# EAGLE design XBee Shield v2.0b (EAGLE 6.3)
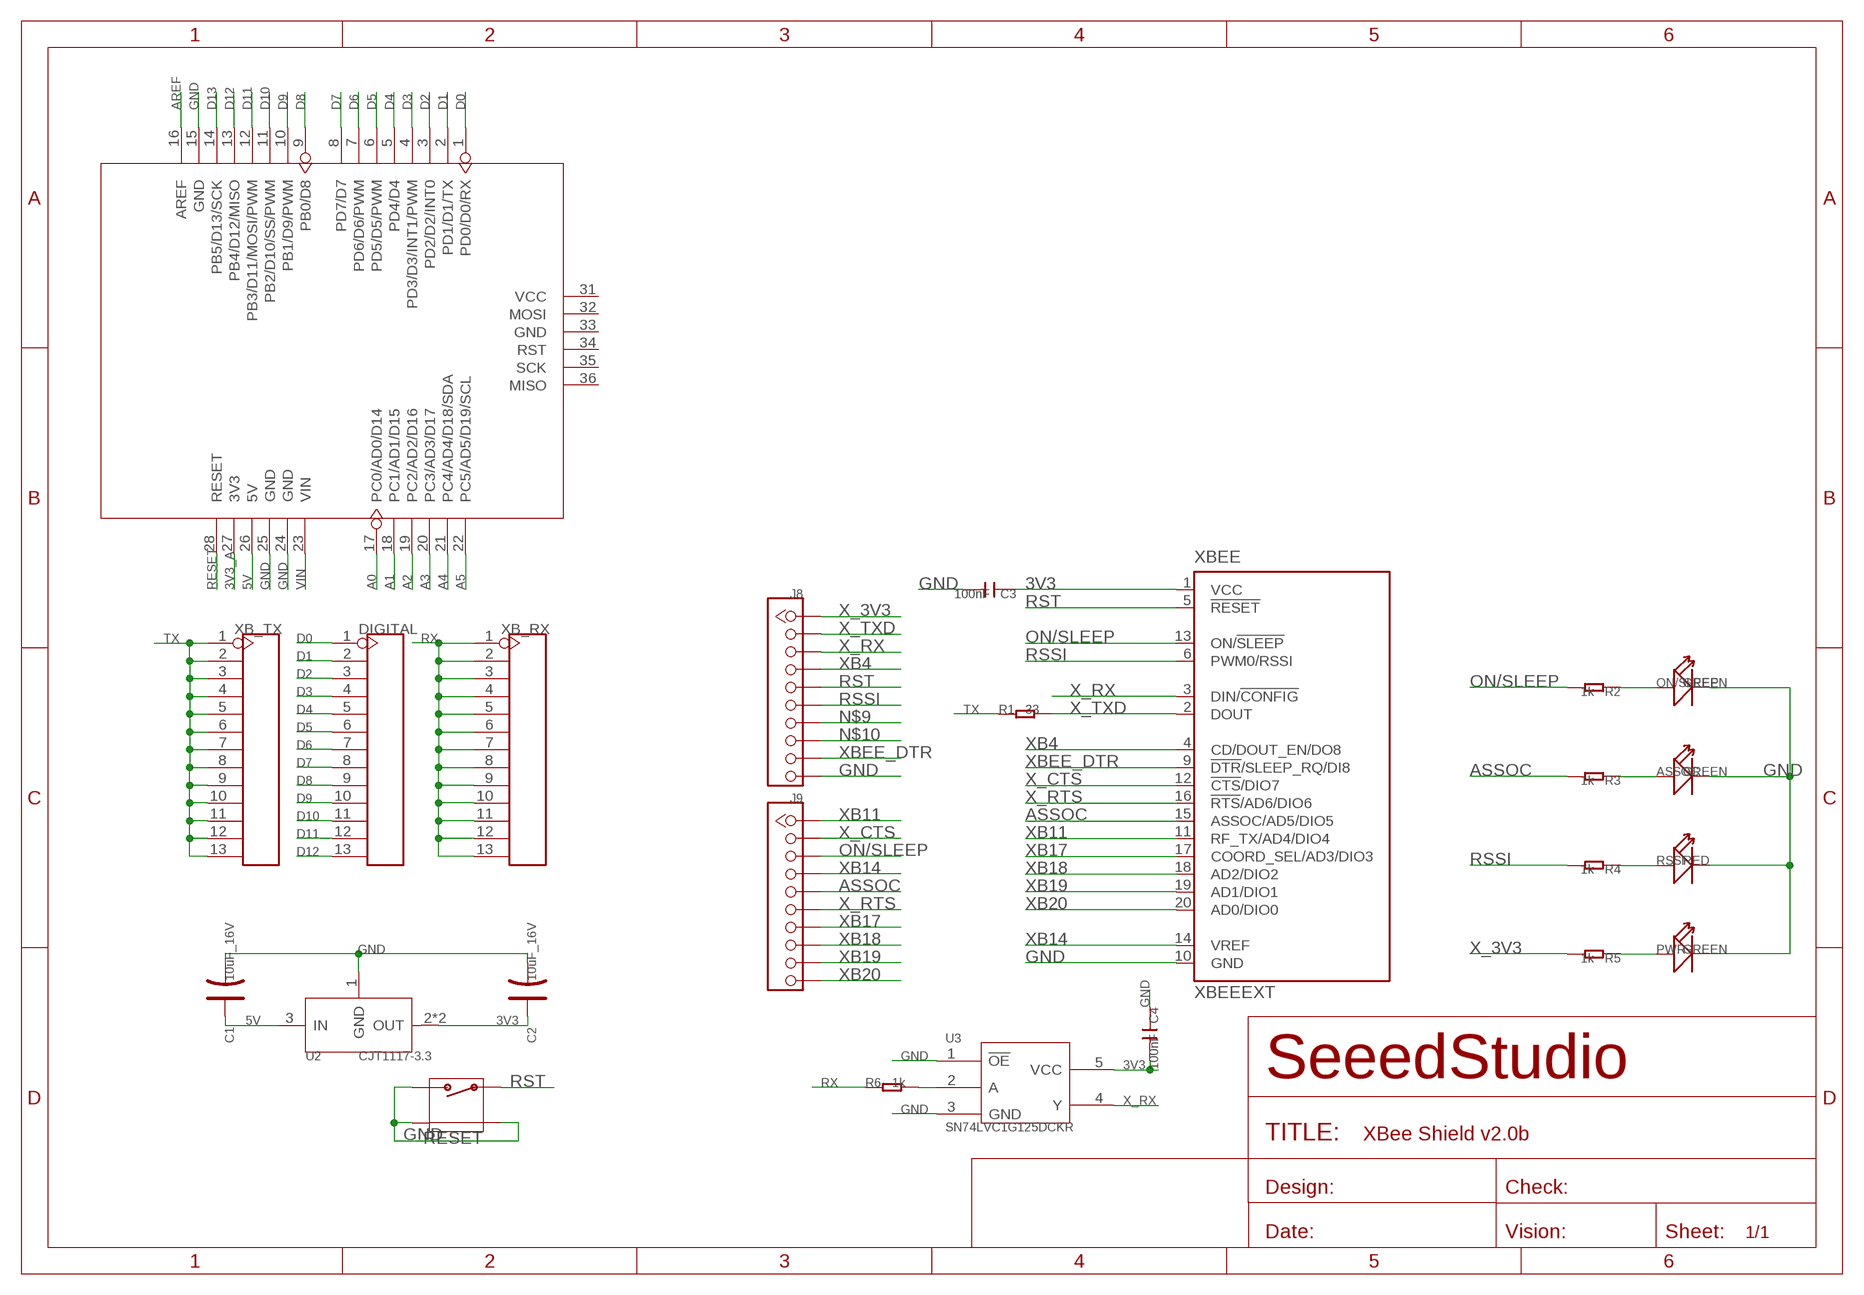
[diagram p0: schematic, sheet 1]

## Parts
ASSOC  GREEN  LED'0603'  [LED-0603]
C1  10uF_16V  CAP-AVX-A  [AVX-A]
C2  10uF_16V  CAP-AVX-A  [AVX-A]
C3  100nF  C-0603  [C0603]
C4  100nF  C-0603  [C0603]
DIGITAL  HEADER-13P  [13P-2.54]
J8  DNP  CK1X10DD  [CK1X10]
J9  DNP  CK1X10DD  [CK1X10]
ON/SLEEP  GREEN  LED'0603'  [LED-0603]
PWR  GREEN  LED'0603'  [LED-0603]
R1  33  R-0603  [R0603]
R2  1k  R-0603  [R0603]
R3  1k  R-0603  [R0603]
R4  1k  R-0603  [R0603]
R5  1k  R-0603  [R0603]
R6  1k  R-0603  [R0603]
RESET  FOR_TEST_ALBERT_V6_BUTTON_4P_SMD  [FOR_TEST_ALBERT_V6_4P-SMD-7X3.5X3.5]
RSSI  RED  LED'0603'  [LED-0603]
U1  ARDUINO'W/O-SILK'  [ARDUINO-W/O-SILK]
U2  CJT1117-3.3  LD1117S  [SOT-223]
U3  SN74LVC1G125DCKR  [SOT353]
XB_RX  HEADER-13P  [13P-2.54]
XB_TX  HEADER-13P  [13P-2.54]
XBEE  XBEEEXT  [XBEE_PLUG]

## Nets
3V3: C2.+ C3.1 C4.2 U2.2(OUT) U2.TER(OUT) U3.5(VCC) XBEE.1(VCC)
3V3_A: U1.27(3V3)
5V: C1.+ U1.26(5V) U2.3(IN)
A0: U1.17(PC0/AD0/D14)
A1: U1.18(PC1/AD1/D15)
A2: U1.19(PC2/AD2/D16)
A3: U1.20(PC3/AD3/D17)
A4: U1.21(PC4/AD4/D18/SDA)
A5: U1.22(PC5/AD5/D19/SCL)
AREF: U1.16(AREF)
ASSOC: J9.5 R3.2 XBEE.15(ASSOC/AD5/DIO5)
D0: DIGITAL.1 U1.1(PD0/D0/RX)
D1: DIGITAL.2 U1.2(PD1/D1/TX)
D2: DIGITAL.3 U1.3(PD2/D2/INT0)
D3: DIGITAL.4 U1.4(PD3/D3/INT1/PWM)
D4: DIGITAL.5 U1.5(PD4/D4)
D5: DIGITAL.6 U1.6(PD5/D5/PWM)
D6: DIGITAL.7 U1.7(PD6/D6/PWM)
D7: DIGITAL.8 U1.8(PD7/D7)
D8: DIGITAL.9 U1.9(PB0/D8)
D9: DIGITAL.10 U1.10(PB1/D9/PWM)
D10: DIGITAL.11 U1.11(PB2/D10/SS/PWM)
D11: DIGITAL.12 U1.12(PB3/D11/MOSI/PWM)
D12: DIGITAL.13 U1.13(PB4/D12/MISO)
D13: U1.14(PB5/D13/SCK)
GND: ASSOC.- C1.- C2.- C3.2 C4.1 J8.10 ON/SLEEP.- PWR.- RESET.2 RESET.S1 RESET.S2 RSSI.- U1.15(GND) U1.24(GND) U1.25(GND) U2.1(GND) U3.1(!OE!) U3.3(GND) XBEE.10(GND)
N$7: ON/SLEEP.+ R2.1
N$8: ASSOC.+ R3.1
N$9: J8.7
N$10: J8.8
N$11: R4.1 RSSI.+
N$14: PWR.+ R5.1
N$132: R6.2 U3.2(A)
ON/SLEEP: J9.3 R2.2 XBEE.13(ON/!SLEEP)
RESET: U1.28(RESET)
RSSI: J8.6 R4.2 XBEE.6(PWM0/RSSI)
RST: J8.5 RESET.1 XBEE.5(!RESET)
RX: R6.1 XB_RX.1 XB_RX.2 XB_RX.3 XB_RX.4 XB_RX.5 XB_RX.6 XB_RX.7 XB_RX.8 XB_RX.9 XB_RX.10 XB_RX.11 XB_RX.12 XB_RX.13
TX: R1.1 XB_TX.1 XB_TX.2 XB_TX.3 XB_TX.4 XB_TX.5 XB_TX.6 XB_TX.7 XB_TX.8 XB_TX.9 XB_TX.10 XB_TX.11 XB_TX.12 XB_TX.13
VIN: U1.23(VIN)
X_3V3: J8.1 R5.2
X_CTS: J9.2 XBEE.12(!CTS!/DIO7)
X_RTS: J9.6 XBEE.16(!RTS!/AD6/DIO6)
X_RX: J8.3 U3.4(Y) XBEE.3(DIN/!CONFIG)
X_TXD: J8.2 R1.2 XBEE.2(DOUT)
XB4: J8.4 XBEE.4(CD/DOUT_EN/DO8)
XB11: J9.1 XBEE.11(RF_TX/AD4/DIO4)
XB14: J9.4 XBEE.14(VREF)
XB17: J9.7 XBEE.17(COORD_SEL/AD3/DIO3)
XB18: J9.8 XBEE.18(AD2/DIO2)
XB19: J9.9 XBEE.19(AD1/DIO1)
XB20: J9.10 XBEE.20(AD0/DIO0)
XBEE_DTR: J8.9 XBEE.9(!DTR!/SLEEP_RQ/DI8)
Unconnected: U1.31(VCC) U1.32(MOSI) U1.33(GND) U1.34(RST) U1.35(SCK) U1.36(MISO)

## Library data of the parts
ASSOC ON/SLEEP PWR RSSI = Discrete:LED*
C1 C2 = Discrete:CAP*: Electrolytic Capacitors,Tantalum Capacitors and Super Capacitors
C3 C4 = Discrete:C*: Ceramic Capacitors
DIGITAL XB_RX XB_TX = Connector:HEADER-13P
J8 J9 = CONNECTER:CK1X10
R1-R6 = Discrete:R*
RESET = TFT_Touch:FOR_TEST_ALBERT_V6_BUTTON_4P_SMD: TS-1188E http://www.best-dz.com/?thread-374-2.html
U1 = moudle:ARDUINO
U2 = IC:LD1117: Low Drop Fixed And Adjustable Positive Voltage Regulators http://www.datasheetcatalog.org/datasheet/SGSThomsonMicroelectronics/mXuqtqv.pdf
U3 = Test:SN74LVC1G125DCKR: Signal bus buffer gate
XBEE = EXT_moudle:XBEE: XBee (TM) /XBee-PRO(TM) OEM RF Modules Source: MaxStream, Inc. xbee_productmanual.pdf

## Net classes
1 power: width 0.61 mm

## Board
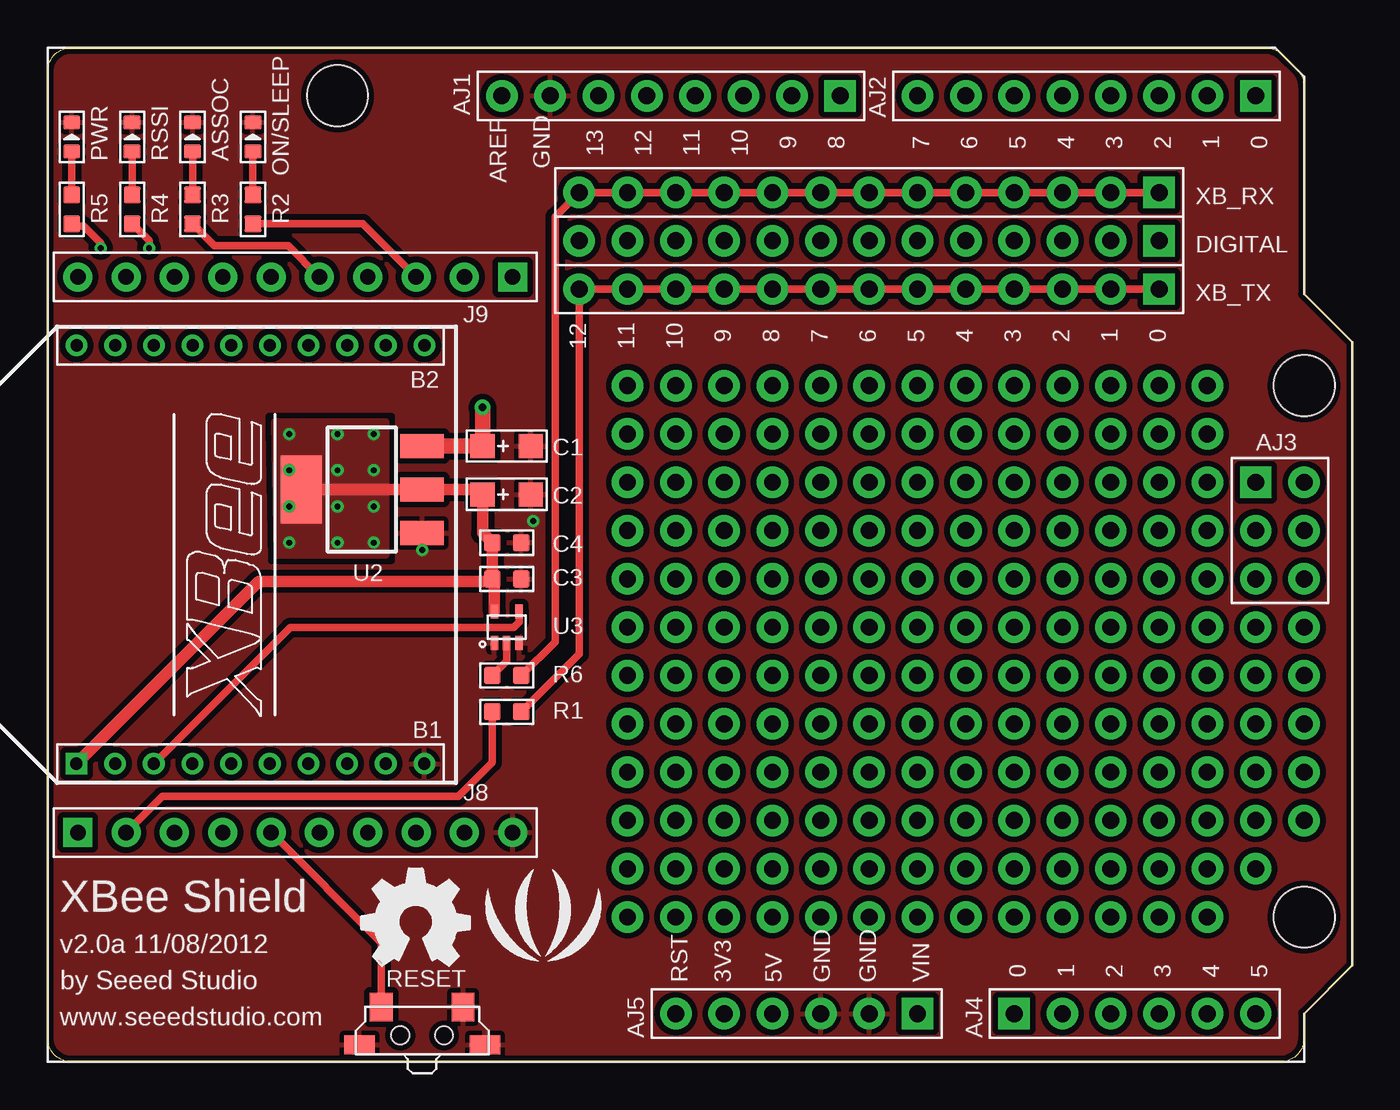
[diagram p1: board, top side]
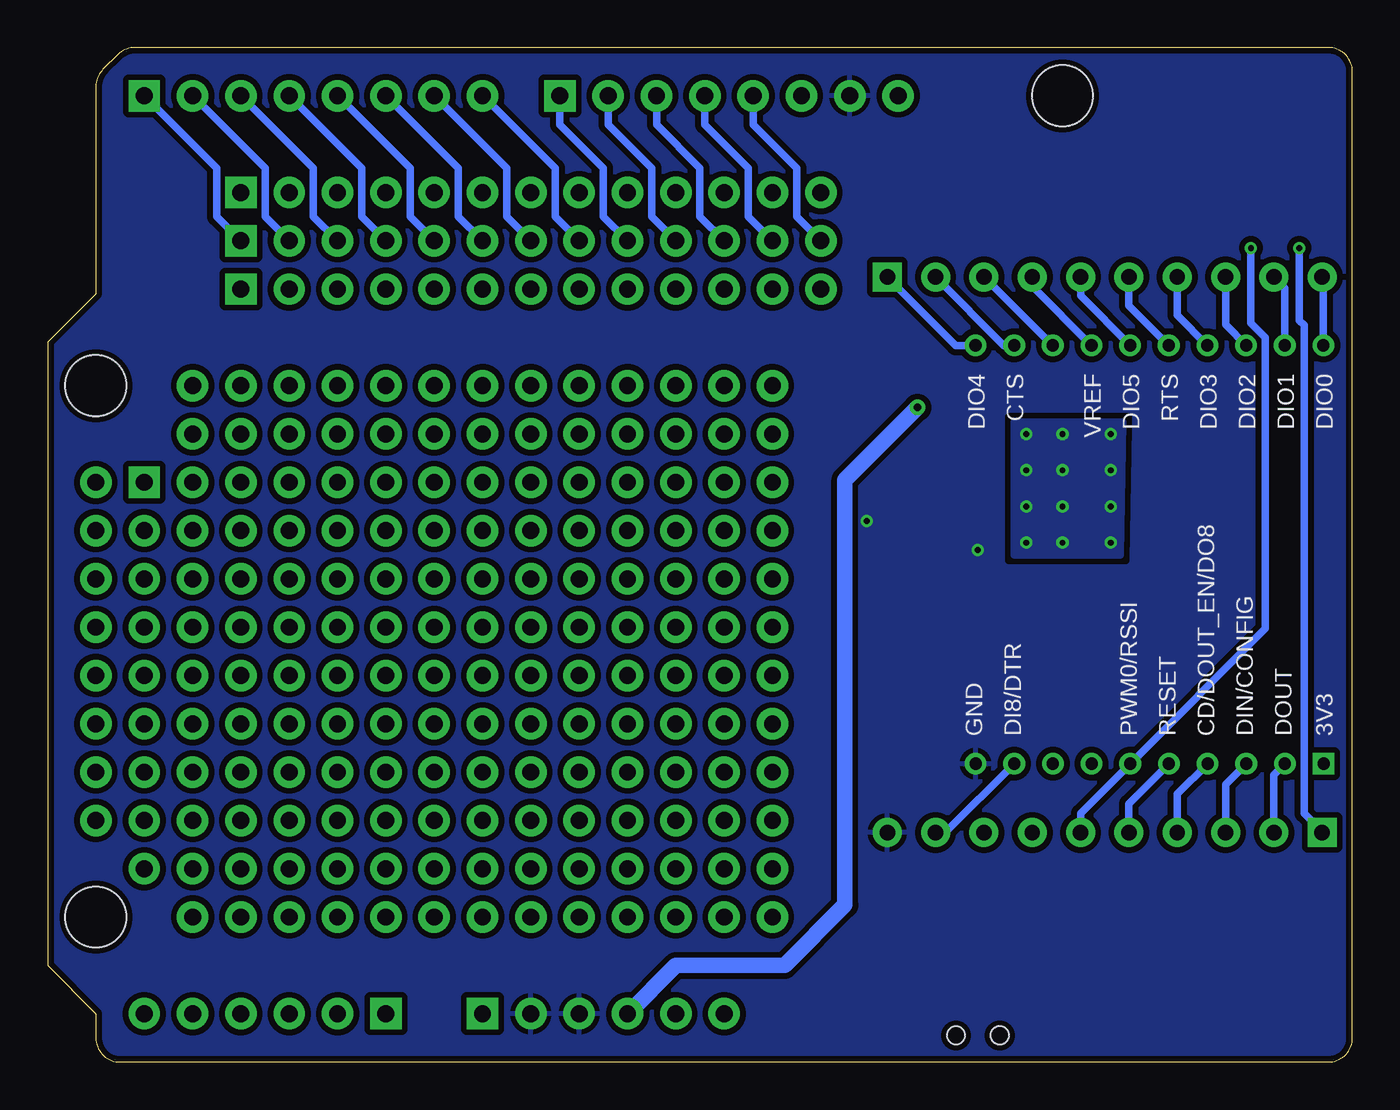
[diagram p2: board, bottom side, seen from below]

Size 68.58 x 53.34 mm. Coordinates in mm from the lower left corner, seen from the top.
Outline: 66.04,2.54 66.04,1.27 arc-90 64.77,0 1.27,0 arc-90 0,1.27 0,52.07 arc-90 1.27,53.34 63.99,53.34 arc-45 64.89,52.97 65.67,52.19 arc-45 66.04,51.29 66.04,40.39 68.58,37.85 68.58,5.08 66.04,2.54
Copper layers (1*16): Top 0.035mm / dielectric 1.5mm / Bottom 0.035mm
Design rules "SeeedStudio_rule_no_angle_090911 *": minimum track width 6mil, minimum drill 12mil, track to track 6mil, track to pad 6mil, pad to pad 6mil, via to via 6mil, smd to smd 0mil, copper to edge 10mil, drill to drill 10mil, minimum pad ring 10mil, minimum via ring 6mil, stop-mask expansion 2mil, vias tented up to drill 25mil, thermal gap 10mil

### Footprints (pad centres in the part's own frame; a part is rotated, then mirrored left to right if it is on the bottom)
LED-0603 = smd 0.762 x 0.889: + -0.762,0; - 0.762,0
AVX-A = smd 1.27 x 1.27: + -1.27,0; - 1.27,0
C0603 = smd 0.889 x 0.889: 1 -0.762,0; 2 0.762,0
13P-2.54 = drill 0.889 pad 1.651 square: 1 -15.24,0 | drill 0.889 pad 1.651: 2 -12.7,0; 3 -10.16,0; 4 -7.62,0; 5 -5.08,0; 6 -2.54,0; 7 0,0; 8 2.54,0; 9 5.08,0; 10 7.62,0; 11 10.16,0; 12 12.7,0; 13 15.24,0
CK1X10 = drill 0.813 pad 1.524 square: 1 0,11.43 | drill 0.813 pad 1.524: 2 0,8.89; 3 0,6.35; 4 0,3.81; 5 0,1.27; 6 0,-1.27; 7 0,-3.81; 8 0,-6.35; 9 0,-8.89; 10 0,-11.43
R0603 = smd 0.889 x 0.889: 1 -0.762,0; 2 0.762,0
FOR_TEST_ALBERT_V6_4P-SMD-7X3.5X3.5 = smd 1.2 x 1.5: 1 -2.15,1.5; 2 2.15,1.5 | smd 1.6 x 1: S1 -3.3,-0.5; S2 3.3,-0.5 | hole 0.95: -1.15,0; 1.15,0
ARDUINO-W/O-SILK = drill 0.889 pad 1.651 square: 1 63.5,50.8; 9 41.656,50.8; 17 50.8,2.54; 23 45.72,2.54; 36 63.5,30.48 | drill 0.889 pad 1.651: 2 60.96,50.8; 3 58.42,50.8; 4 55.88,50.8; 5 53.34,50.8; 6 50.8,50.8; 7 48.26,50.8; 8 45.72,50.8; 10 39.116,50.8; 11 36.576,50.8; 12 34.036,50.8; 13 31.496,50.8; 14 28.956,50.8; 15 26.416,50.8; 16 23.876,50.8; 18 53.34,2.54; 19 55.88,2.54; 20 58.42,2.54; 21 60.96,2.54; 22 63.5,2.54; 24 43.18,2.54; 25 40.64,2.54; 26 38.1,2.54; 27 35.56,2.54; 28 33.02,2.54; 31 66.04,30.48; 32 66.04,27.94; 33 66.04,25.4; 34 63.5,25.4; 35 63.5,27.94 | hole 3.2: 15.24,50.8; 66.04,35.56; 66.04,7.62
SOT-223 = smd 1.27 x 2.286: 1 -2.286,-3.175; 2 0,-3.175; 3 2.286,-3.175 | smd 3.556 x 2.159: TER 0,3.175
SOT353 = smd 0.4 x 0.75: 1 -0.65,-0.825; 2 0,-0.825; 3 0.65,-0.825; 4 0.65,0.825; 5 -0.65,0.825
XBEE_PLUG = drill 0.635 pad 1.016 square: 1 0,0.008 | drill 0.635 pad 1.016: 2 0,-2.024; 3 0,-4.056; 4 0,-6.088; 5 0,-8.12; 6 0,-10.152; 7 0,-12.184; 8 0,-14.216; 9 0,-16.248; 10 0,-18.28; 11 21.996,-18.288; 12 21.996,-16.256; 13 21.996,-14.224; 14 21.996,-12.192; 15 21.996,-10.16; 16 21.996,-8.128; 17 21.996,-6.096; 18 21.996,-4.064; 19 21.996,-2.032; 20 21.996,0

### Placement (x,y rotation side)
ASSOC  7.62,48.64 90 top
C1  24.13,32.38 0 top
C2  24.13,29.84 0 top
C3  24.13,25.4 0 top
C4  24.13,27.3 180 top
DIGITAL  43.18,43.18 180 top
J8  13.02,12.06 90 top
J9  13.02,41.27 270 top
ON/SLEEP  10.79,48.64 90 top
PWR  1.27,48.64 90 top
R1  24.13,18.41 180 top
R2  10.79,44.83 270 top
R3  7.62,44.83 270 top
R4  4.45,44.83 270 top
R5  1.27,44.83 270 top
R6  24.13,20.32 180 top
RESET  19.68,1.4 0 top
RSSI  4.45,48.64 90 top
U1  0,0 0 top
U2  16.51,30.1 90 top
U3  24.13,22.86 0 top
U$2  [LOGO_SILK]  26.04,6.99 0 top
U$3  [OSHW_FILLX200_NOTEXT]  16.51,5.08 0 top
XB_RX  43.18,45.72 180 top
XB_TX  43.18,40.64 180 top
XBEE  1.52,15.68 90 top

### Tracks (layer width: path | path; a pad name or v marks a point on that pad's centre or on a via)
3V3  (via drill 0.3 pad 0.64)
  Top 0.406: 23.48,25.41 23.37,25.53
  Top 0.61: U2.TER U2.2 22.73,30.1 | 22.73,30.1 22.86,29.97 C2.+ 22.86,27.81 C4.2 23.37,25.53 C3.1 23.37,25.27 11.11,25.27 XBEE.1 | 22.73,30.1 22.86,30.1 | U3.5 23.48,25.41
  other vias: 12.7,31.11 15.24,29.21 15.24,31.11 12.7,29.21 12.7,27.3 15.24,27.3 17.14,27.3 17.14,29.21 17.14,31.11 17.14,33.02 15.24,33.02 12.7,33.02
  pour Top (isolate 0.406, no thermals): 12.06,33.66 17.78,33.66 17.78,26.67 12.19,26.67
  pour Bottom (isolate 0.406, no thermals): 12.06,33.66 17.78,33.66 17.78,26.67 12.19,26.67
  pour Top (isolate 0.406, no thermals): 11.94,33.66 17.65,33.66 17.65,26.67 12.06,26.67
5V  (via drill 0.38 pad 0.81)
  Top 0.61: 23.11,32.38 C1.+
  Top 0.813: v22.86,34.42 22.86,32.51 22.73,32.38 | 22.73,32.38 22.61,32.26 22.73,32.26 C1.+ 22.73,32.38 | U2.3 22.73,32.38
  Bottom 0.813: U1.26 35.56,5.08 29.84,5.08 26.67,8.26 26.67,30.61 v22.86,34.42
ASSOC
  Top 0.406: R3.2 8.76,42.93 12.64,42.93 J9.5
  Bottom 0.406: J9.5 14.29,40.28 XBEE.15
D0
  Bottom 0.406: U1.1 59.69,46.99 59.69,44.45 DIGITAL.1
D1
  Bottom 0.406: U1.2 57.15,46.99 57.15,44.45 DIGITAL.2
D2
  Bottom 0.406: U1.3 54.61,46.99 54.61,44.45 DIGITAL.3
D3
  Bottom 0.406: U1.4 52.07,46.99 52.07,44.45 DIGITAL.4
D4
  Bottom 0.406: U1.5 49.53,46.99 49.53,44.45 DIGITAL.5
D5
  Bottom 0.406: U1.6 46.99,46.99 46.99,44.45 DIGITAL.6
D6
  Bottom 0.406: U1.7 44.45,46.99 44.45,44.45 DIGITAL.7
D7
  Bottom 0.406: U1.8 41.91,46.99 41.91,44.45 DIGITAL.8
D8
  Bottom 0.406: U1.9 41.66,49.28 39.37,46.99 39.37,44.45 DIGITAL.9
D9
  Bottom 0.406: U1.10 39.12,49.28 36.83,46.99 36.83,44.45 DIGITAL.10
D10
  Bottom 0.406: U1.11 36.58,49.28 34.29,46.99 34.29,44.45 DIGITAL.11
D11
  Bottom 0.406: U1.12 34.04,49.28 31.75,46.99 31.75,44.45 DIGITAL.12
D12
  Bottom 0.406: U1.13 31.5,49.28 29.21,46.99 29.21,44.45 DIGITAL.13
GND  (via drill 0.3 pad 0.64)
  other vias: 19.68,26.92 25.53,28.45
  pour Top (isolate 0.305, rank 6): 0,53.34 0,0 66.04,0 66.04,2.54 68.58,5.08 68.58,37.85 66.04,40.39 66.04,51.82 64.52,53.34
  pour Bottom (isolate 0.305, rank 6): 0,0 66.04,0 66.04,2.54 68.58,5.08 68.58,37.85 66.04,40.39 66.04,51.82 64.52,53.34 0,53.34
N$2  (via drill 0.89 pad 1.65)
  other vias: 30.48,27.94
N$4  (via drill 0.89 pad 1.65)
  other vias: 30.48,25.4
N$5  (via drill 0.89 pad 1.65)
  other vias: 30.48,30.48
N$6  (via drill 0.89 pad 1.65)
  other vias: 30.48,22.86
N$7
  Top 0.406: ON/SLEEP.+ R2.1
N$8
  Top 0.406: ASSOC.+ R3.1
N$11
  Top 0.406: RSSI.+ R4.1
N$12  (via drill 0.89 pad 1.65)
  other vias: 33.02,27.94
N$13  (via drill 0.89 pad 1.65)
  other vias: 33.02,25.4
N$14
  Top 0.406: R5.1 PWR.+
N$15  (via drill 0.89 pad 1.65)
  other vias: 33.02,22.86
N$16  (via drill 0.89 pad 1.65)
  other vias: 35.56,27.94
N$17  (via drill 0.89 pad 1.65)
  other vias: 35.56,25.4
N$18  (via drill 0.89 pad 1.65)
  other vias: 35.56,22.86
N$19  (via drill 0.89 pad 1.65)
  other vias: 38.1,27.94
N$20  (via drill 0.89 pad 1.65)
  other vias: 38.1,25.4
N$21  (via drill 0.89 pad 1.65)
  other vias: 38.1,22.86
N$22  (via drill 0.89 pad 1.65)
  other vias: 40.64,27.94
N$23  (via drill 0.89 pad 1.65)
  other vias: 40.64,25.4
N$24  (via drill 0.89 pad 1.65)
  other vias: 40.64,22.86
N$25  (via drill 0.89 pad 1.65)
  other vias: 43.18,27.94
N$26  (via drill 0.89 pad 1.65)
  other vias: 43.18,25.4
N$27  (via drill 0.89 pad 1.65)
  other vias: 43.18,22.86
N$28  (via drill 0.89 pad 1.65)
  other vias: 45.72,27.94
N$29  (via drill 0.89 pad 1.65)
  other vias: 45.72,25.4
N$30  (via drill 0.89 pad 1.65)
  other vias: 45.72,22.86
N$31  (via drill 0.89 pad 1.65)
  other vias: 48.26,27.94
N$32  (via drill 0.89 pad 1.65)
  other vias: 48.26,25.4
N$33  (via drill 0.89 pad 1.65)
  other vias: 48.26,22.86
N$34  (via drill 0.89 pad 1.65)
  other vias: 50.8,27.94
N$35  (via drill 0.89 pad 1.65)
  other vias: 50.8,25.4
N$36  (via drill 0.89 pad 1.65)
  other vias: 50.8,22.86
N$37  (via drill 0.89 pad 1.65)
  other vias: 53.34,27.94
N$38  (via drill 0.89 pad 1.65)
  other vias: 53.34,25.4
N$39  (via drill 0.89 pad 1.65)
  other vias: 53.34,22.86
N$40  (via drill 0.89 pad 1.65)
  other vias: 55.88,27.94
N$41  (via drill 0.89 pad 1.65)
  other vias: 55.88,25.4
N$42  (via drill 0.89 pad 1.65)
  other vias: 55.88,22.86
N$43  (via drill 0.89 pad 1.65)
  other vias: 58.42,27.94
N$44  (via drill 0.89 pad 1.65)
  other vias: 58.42,25.4
N$45  (via drill 0.89 pad 1.65)
  other vias: 58.42,22.86
N$46  (via drill 0.89 pad 1.65)
  other vias: 60.96,27.94
N$47  (via drill 0.89 pad 1.65)
  other vias: 60.96,25.4
N$48  (via drill 0.89 pad 1.65)
  other vias: 60.96,22.86
N$49  (via drill 0.89 pad 1.65)
  other vias: 30.48,20.32
N$50  (via drill 0.89 pad 1.65)
  other vias: 30.48,17.78
N$52  (via drill 0.89 pad 1.65)
  other vias: 30.48,15.24
N$54  (via drill 0.89 pad 1.65)
  other vias: 33.02,20.32
N$55  (via drill 0.89 pad 1.65)
  other vias: 33.02,30.48
N$56  (via drill 0.89 pad 1.65)
  other vias: 33.02,17.78
N$57  (via drill 0.89 pad 1.65)
  other vias: 33.02,15.24
N$58  (via drill 0.89 pad 1.65)
  other vias: 35.56,20.32
N$59  (via drill 0.89 pad 1.65)
  other vias: 35.56,17.78
N$60  (via drill 0.89 pad 1.65)
  other vias: 35.56,15.24
N$61  (via drill 0.89 pad 1.65)
  other vias: 38.1,20.32
N$62  (via drill 0.89 pad 1.65)
  other vias: 38.1,17.78
N$63  (via drill 0.89 pad 1.65)
  other vias: 38.1,15.24
N$64  (via drill 0.89 pad 1.65)
  other vias: 40.64,20.32
N$65  (via drill 0.89 pad 1.65)
  other vias: 40.64,17.78
N$66  (via drill 0.89 pad 1.65)
  other vias: 40.64,15.24
N$67  (via drill 0.89 pad 1.65)
  other vias: 43.18,20.32
N$68  (via drill 0.89 pad 1.65)
  other vias: 43.18,17.78
N$69  (via drill 0.89 pad 1.65)
  other vias: 43.18,15.24
N$70  (via drill 0.89 pad 1.65)
  other vias: 45.72,20.32
N$71  (via drill 0.89 pad 1.65)
  other vias: 45.72,17.78
N$72  (via drill 0.89 pad 1.65)
  other vias: 45.72,15.24
N$73  (via drill 0.89 pad 1.65)
  other vias: 48.26,20.32
N$74  (via drill 0.89 pad 1.65)
  other vias: 48.26,17.78
N$75  (via drill 0.89 pad 1.65)
  other vias: 48.26,15.24
N$76  (via drill 0.89 pad 1.65)
  other vias: 50.8,20.32
N$77  (via drill 0.89 pad 1.65)
  other vias: 50.8,17.78
N$78  (via drill 0.89 pad 1.65)
  other vias: 50.8,15.24
N$79  (via drill 0.89 pad 1.65)
  other vias: 53.34,20.32
N$80  (via drill 0.89 pad 1.65)
  other vias: 53.34,17.78
N$81  (via drill 0.89 pad 1.65)
  other vias: 53.34,15.24
N$82  (via drill 0.89 pad 1.65)
  other vias: 55.88,20.32
N$83  (via drill 0.89 pad 1.65)
  other vias: 55.88,17.78
N$84  (via drill 0.89 pad 1.65)
  other vias: 55.88,15.24
N$85  (via drill 0.89 pad 1.65)
  other vias: 58.42,20.32
N$86  (via drill 0.89 pad 1.65)
  other vias: 58.42,17.78
N$87  (via drill 0.89 pad 1.65)
  other vias: 58.42,15.24
N$88  (via drill 0.89 pad 1.65)
  other vias: 60.96,20.32
N$89  (via drill 0.89 pad 1.65)
  other vias: 60.96,17.78
N$90  (via drill 0.89 pad 1.65)
  other vias: 60.96,15.24
N$91  (via drill 0.89 pad 1.65)
  other vias: 30.48,12.7
N$93  (via drill 0.89 pad 1.65)
  other vias: 63.5,22.86
N$94  (via drill 0.89 pad 1.65)
  other vias: 33.02,12.7
N$98  (via drill 0.89 pad 1.65)
  other vias: 66.04,22.86
N$99  (via drill 0.89 pad 1.65)
  other vias: 35.56,30.48
N$100  (via drill 0.89 pad 1.65)
  other vias: 35.56,12.7
N$102  (via drill 0.89 pad 1.65)
  other vias: 63.5,20.32
N$103  (via drill 0.89 pad 1.65)
  other vias: 38.1,7.62
N$105  (via drill 0.89 pad 1.65)
  other vias: 63.5,17.78
N$106  (via drill 0.89 pad 1.65)
  other vias: 40.64,12.7
N$108  (via drill 0.89 pad 1.65)
  other vias: 63.5,15.24
N$109  (via drill 0.89 pad 1.65)
  other vias: 43.18,12.7
N$111  (via drill 0.89 pad 1.65)
  other vias: 66.04,20.32
N$112  (via drill 0.89 pad 1.65)
  other vias: 45.72,12.7
N$114  (via drill 0.89 pad 1.65)
  other vias: 66.04,17.78
N$115  (via drill 0.89 pad 1.65)
  other vias: 48.26,12.7
N$117  (via drill 0.89 pad 1.65)
  other vias: 66.04,15.24
N$118  (via drill 0.89 pad 1.65)
  other vias: 50.8,12.7
N$120  (via drill 0.89 pad 1.65)
  other vias: 63.5,12.7
N$121  (via drill 0.89 pad 1.65)
  other vias: 53.34,12.7
N$123  (via drill 0.89 pad 1.65)
  other vias: 63.5,10.16
N$124  (via drill 0.89 pad 1.65)
  other vias: 55.88,12.7
N$126  (via drill 0.89 pad 1.65)
  other vias: 66.04,12.7
N$127  (via drill 0.89 pad 1.65)
  other vias: 58.42,12.7
N$130  (via drill 0.89 pad 1.65)
  other vias: 60.96,12.7
N$131  (via drill 0.89 pad 1.65)
  other vias: 30.48,33.02
N$132
  Top 0.406: U3.2 24.13,21.08 R6.2
N$133  (via drill 0.89 pad 1.65)
  other vias: 60.96,7.62
N$135  (via drill 0.89 pad 1.65)
  other vias: 35.56,10.16
N$136  (via drill 0.89 pad 1.65)
  other vias: 35.56,7.62
N$137  (via drill 0.89 pad 1.65)
  other vias: 33.02,7.62
N$138  (via drill 0.89 pad 1.65)
  other vias: 30.48,7.62
N$139  (via drill 0.89 pad 1.65)
  other vias: 30.48,10.16
N$140  (via drill 0.89 pad 1.65)
  other vias: 33.02,10.16
N$141  (via drill 0.89 pad 1.65)
  other vias: 43.18,7.62
N$142  (via drill 0.89 pad 1.65)
  other vias: 45.72,7.62
N$143  (via drill 0.89 pad 1.65)
  other vias: 38.1,30.48
N$144  (via drill 0.89 pad 1.65)
  other vias: 48.26,7.62
N$145  (via drill 0.89 pad 1.65)
  other vias: 50.8,7.62
N$146  (via drill 0.89 pad 1.65)
  other vias: 53.34,7.62
N$147  (via drill 0.89 pad 1.65)
  other vias: 55.88,7.62
N$148  (via drill 0.89 pad 1.65)
  other vias: 58.42,7.62
N$149  (via drill 0.89 pad 1.65)
  other vias: 60.96,10.16
N$150  (via drill 0.89 pad 1.65)
  other vias: 58.42,10.16
N$151  (via drill 0.89 pad 1.65)
  other vias: 55.88,10.16
N$152  (via drill 0.89 pad 1.65)
  other vias: 53.34,10.16
N$153  (via drill 0.89 pad 1.65)
  other vias: 50.8,10.16
N$154  (via drill 0.89 pad 1.65)
  other vias: 48.26,10.16
N$155  (via drill 0.89 pad 1.65)
  other vias: 43.18,10.16
N$156  (via drill 0.89 pad 1.65)
  other vias: 33.02,33.02
N$157  (via drill 0.89 pad 1.65)
  other vias: 35.56,33.02
N$158  (via drill 0.89 pad 1.65)
  other vias: 38.1,33.02
N$159  (via drill 0.89 pad 1.65)
  other vias: 40.64,33.02
N$160  (via drill 0.89 pad 1.65)
  other vias: 43.18,33.02
N$161  (via drill 0.89 pad 1.65)
  other vias: 45.72,33.02
N$162  (via drill 0.89 pad 1.65)
  other vias: 48.26,33.02
N$163  (via drill 0.89 pad 1.65)
  other vias: 50.8,33.02
N$164  (via drill 0.89 pad 1.65)
  other vias: 53.34,33.02
N$165  (via drill 0.89 pad 1.65)
  other vias: 55.88,33.02
N$166  (via drill 0.89 pad 1.65)
  other vias: 58.42,33.02
N$167  (via drill 0.89 pad 1.65)
  other vias: 30.48,35.56
N$168  (via drill 0.89 pad 1.65)
  other vias: 33.02,35.56
N$169  (via drill 0.89 pad 1.65)
  other vias: 35.56,35.56
N$170  (via drill 0.89 pad 1.65)
  other vias: 38.1,35.56
N$171  (via drill 0.89 pad 1.65)
  other vias: 40.64,35.56
N$172  (via drill 0.89 pad 1.65)
  other vias: 43.18,35.56
N$173  (via drill 0.89 pad 1.65)
  other vias: 45.72,35.56
N$174  (via drill 0.89 pad 1.65)
  other vias: 48.26,35.56
N$175  (via drill 0.89 pad 1.65)
  other vias: 50.8,35.56
N$176  (via drill 0.89 pad 1.65)
  other vias: 53.34,35.56
N$177  (via drill 0.89 pad 1.65)
  other vias: 55.88,35.56
N$178  (via drill 0.89 pad 1.65)
  other vias: 58.42,35.56
N$179  (via drill 0.89 pad 1.65)
  other vias: 60.96,30.48
N$180  (via drill 0.89 pad 1.65)
  other vias: 60.96,33.02
N$181  (via drill 0.89 pad 1.65)
  other vias: 60.96,35.56
N$182  (via drill 0.89 pad 1.65)
  other vias: 38.1,12.7
N$183  (via drill 0.89 pad 1.65)
  other vias: 38.1,10.16
N$184  (via drill 0.89 pad 1.65)
  other vias: 40.64,10.16
N$185  (via drill 0.89 pad 1.65)
  other vias: 40.64,7.62
N$187  (via drill 0.89 pad 1.65)
  other vias: 40.64,30.48
N$231  (via drill 0.89 pad 1.65)
  other vias: 43.18,30.48
N$275  (via drill 0.89 pad 1.65)
  other vias: 45.72,30.48
N$319  (via drill 0.89 pad 1.65)
  other vias: 48.26,30.48
N$363  (via drill 0.89 pad 1.65)
  other vias: 50.8,30.48
N$407  (via drill 0.89 pad 1.65)
  other vias: 53.34,30.48
N$451  (via drill 0.89 pad 1.65)
  other vias: 55.88,30.48
N$495  (via drill 0.89 pad 1.65)
  other vias: 58.42,30.48
N$539  (via drill 0.89 pad 1.65)
  other vias: 45.72,10.16
ON/SLEEP
  Top 0.406: R2.2 16.57,44.07 J9.3
  Bottom 0.406: J9.3 19.34,41.27 XBEE.13
RSSI  (via drill 0.3 pad 0.64)
  Top 0.406: R4.2 5.33,43.18 v5.33,42.8
  Bottom 0.406: v5.33,42.8 5.33,38.86 4.57,38.1 4.57,22.79 XBEE.6 14.29,13.07 J8.6
RST
  Top 0.406: RESET.1 17.54,6.28 J8.5
  Bottom 0.406: J8.5 11.75,13.58 XBEE.5
RX
  Top 0.406: R6.1 26.67,22.1 26.67,44.45 XB_RX.13 XB_RX.12 XB_RX.11 XB_RX.10 XB_RX.9 XB_RX.8 XB_RX.7 XB_RX.6 XB_RX.5 XB_RX.4 XB_RX.3 XB_RX.2 XB_RX.1
TX
  Top 0.406: R1.1 27.94,21.46 XB_TX.13 XB_TX.12 XB_TX.11 XB_TX.10 XB_TX.9 XB_TX.8 XB_TX.7 XB_TX.6 XB_TX.5 XB_TX.4 XB_TX.3 XB_TX.2 XB_TX.1
X_3V3  (via drill 0.3 pad 0.64)
  Top 0.406: v2.79,42.8 2.79,43.05 1.91,43.94 1.4,43.94 R5.2
  Bottom 0.406: J8.1 1.59,12.13 2.54,13.08 2.54,38.73 2.79,38.99 v2.79,42.8
X_CTS
  Bottom 0.406: XBEE.12 18.31,37.68 J9.2
X_RTS
  Bottom 0.406: J9.6 11.75,39.78 XBEE.16
X_RX
  Top 0.406: U3.4 24.78,23.13 24.51,22.86 12.76,22.86 XBEE.3
  Bottom 0.406: J8.3 6.67,14.6 XBEE.3
X_TXD
  Top 0.406: R1.2 23.37,15.75 21.59,13.97 6.03,13.97 J8.2
  Bottom 0.406: XBEE.2 4.13,15.11 J8.2
XB4
  Bottom 0.406: J8.4 9.21,14.09 XBEE.4
XB11
  Bottom 0.406: XBEE.11 20.85,37.68 J9.1
XB14
  Bottom 0.406: J9.4 16.83,40.79 XBEE.14
XB17
  Bottom 0.406: J9.7 9.21,39.27 XBEE.17
XB18
  Bottom 0.406: J9.8 6.67,38.76 XBEE.18
XB19
  Bottom 0.406: XBEE.19 3.56,40.7 J9.9
XB20
  Bottom 0.406: XBEE.20 1.52,41.21 J9.10
XBEE_DTR
  Bottom 0.406: XBEE.9 21.39,12.06 J8.9

### Text on the board
tPlace: AJ1 | AJ2 | 13 | 12 | 11 | 10 | 9 | 8 | 7 | 6 | 5 | 4 | 3 | 2 | 1 | 0 | GND | AREF | 9 | 8 | 7 | 6 | 5 | 4 | 3 | 2 | 1 | 0 | 12 | 11 | 10 | B2 | AJ3 | B1 | XBee Shield | v2.0a 11/08/2012 | by Seeed Studio | RST | 3V3 | 5V | GND | GND | VIN | 0 | 1 | 2 | 3 | 4 | 5 | www.seeedstudio.com | AJ5 | AJ4
bPlace: DIO0 | DIO1 | DIO2 | DIO3 | RTS | DIO5 | VREF | CTS | DIO4 | 3V3 | DOUT | DIN/CONFIG | CD/DOUT_EN/DO8 | RESET | PWM0/RSSI | DI8/DTR | GND